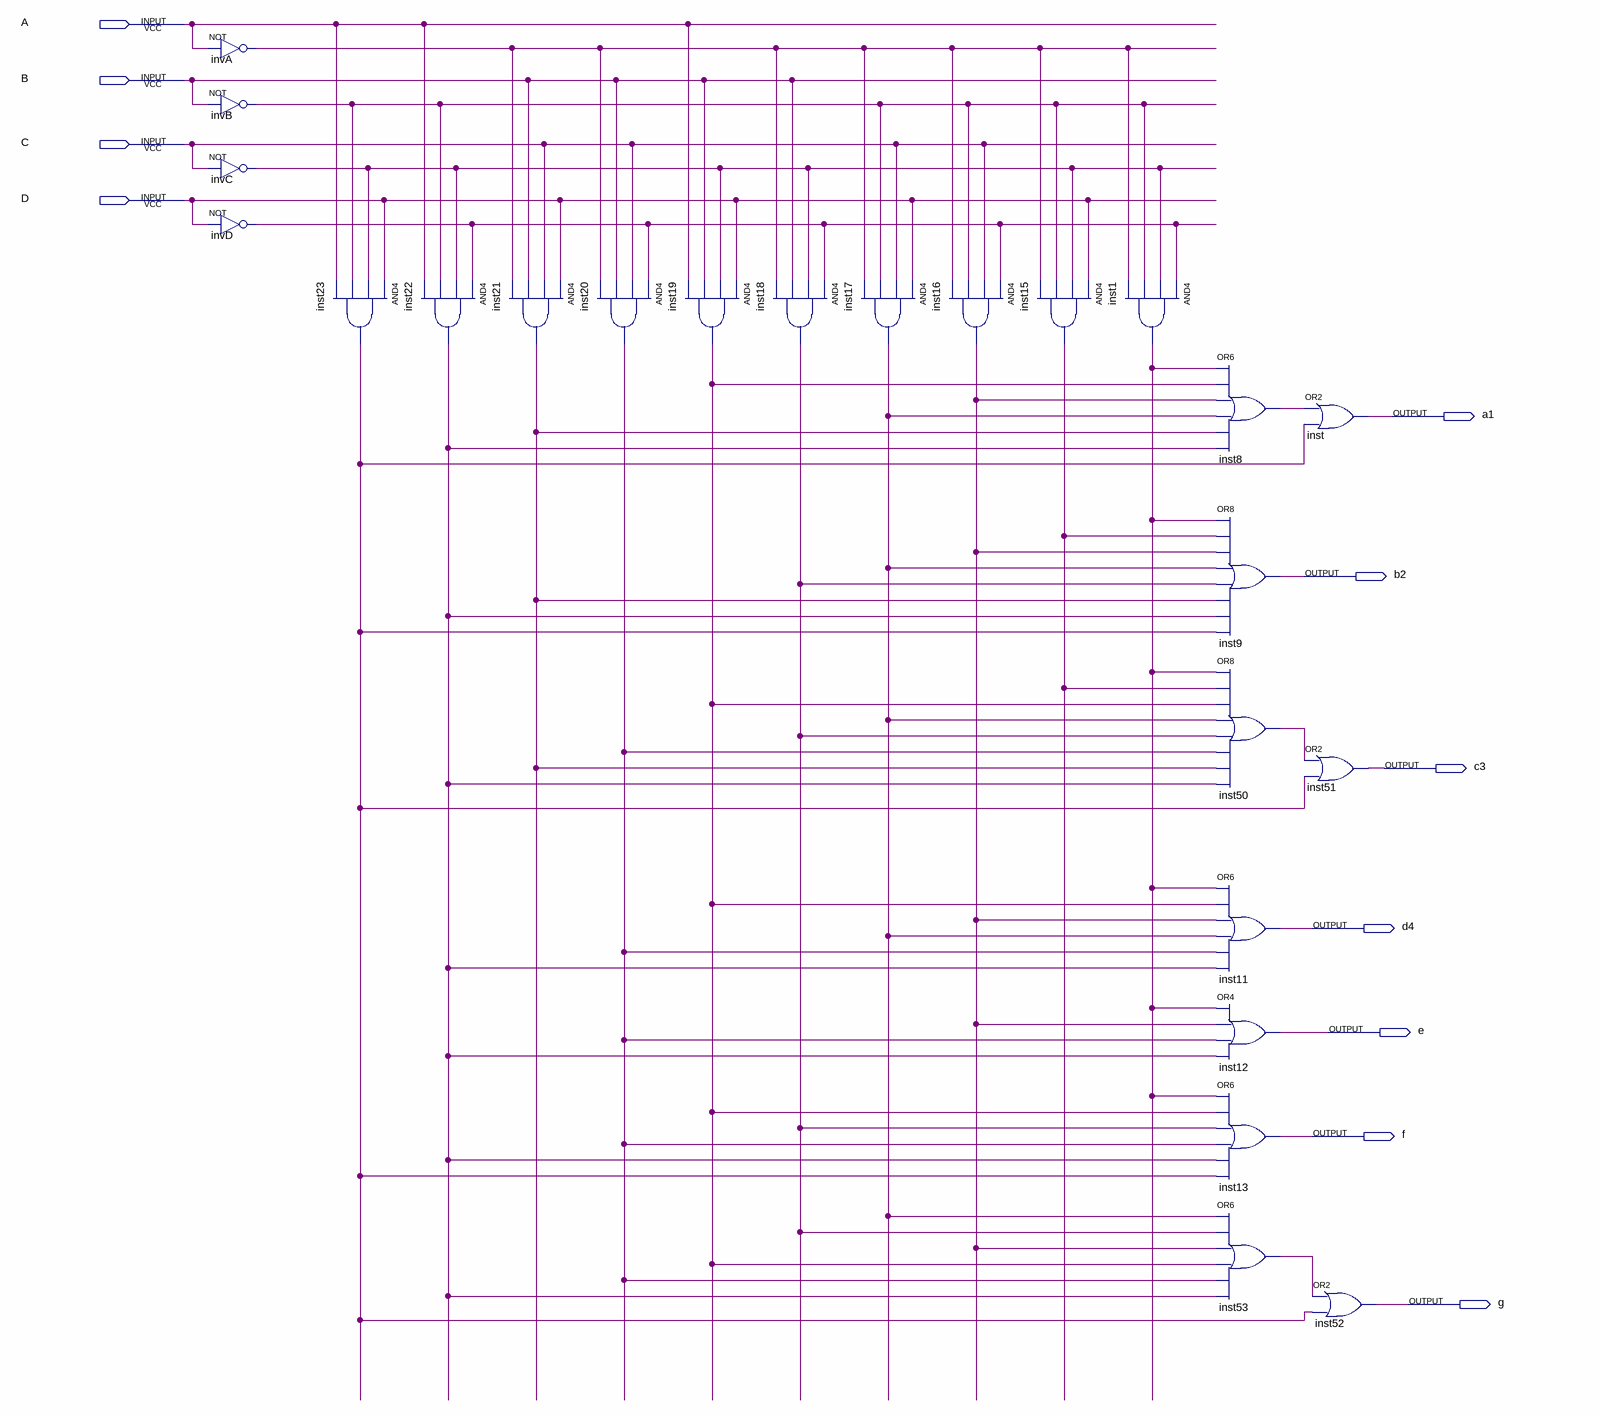
[diagram p0: schematic sheet]
// Quartus schematic DisplayOK.bdf as structural Verilog: 24 symbols, 11 pins
module DisplayOK (
  input  A,
  input  B,
  input  C,
  input  D,
  output a1,
  output b2,
  output c3,
  output d4,
  output e,
  output f,
  output g
);

  wire inst1_out, inst8_out, inst15_out, inst16_out, inst17_out, inst18_out, inst19_out, inst20_out,
       inst21_out, inst22_out, inst23_out, inst50_out, inst53_out, invA_out, invB_out, invC_out, invD_out;

  not invA (invA_out, A);
  not invB (invB_out, B);
  not invC (invC_out, C);
  not invD (invD_out, D);
  and inst23 (inst23_out, D, invC_out, invB_out, A);
  and inst22 (inst22_out, invD_out, invC_out, invB_out, A);
  and inst21 (inst21_out, D, C, B, invA_out);
  and inst20 (inst20_out, invD_out, C, B, invA_out);
  and inst19 (inst19_out, D, invC_out, B, A);
  and inst18 (inst18_out, invD_out, invC_out, B, invA_out);
  and inst17 (inst17_out, D, C, invB_out, invA_out);
  and inst16 (inst16_out, invD_out, C, invB_out, invA_out);
  and inst15 (inst15_out, D, invC_out, invB_out, invA_out);
  and inst1 (inst1_out, invD_out, invC_out, invB_out, invA_out);
  or inst8 (inst8_out, inst1_out, inst19_out, inst16_out, inst17_out, inst21_out, inst22_out);
  or inst9 (b2, inst1_out, inst15_out, inst16_out, inst17_out, inst18_out, inst21_out, inst22_out, inst23_out);
  or inst50 (inst50_out, inst1_out, inst15_out, inst19_out, inst17_out, inst18_out, inst20_out, inst21_out, inst22_out);
  or inst11 (d4, inst1_out, inst19_out, inst16_out, inst17_out, inst20_out, inst22_out);
  or inst12 (e, inst1_out, inst16_out, inst20_out, inst22_out);
  or inst13 (f, inst1_out, inst19_out, inst18_out, inst20_out, inst22_out, inst23_out);
  or inst53 (inst53_out, inst17_out, inst18_out, inst16_out, inst19_out, inst20_out, inst22_out);
  or inst (a1, inst8_out, inst23_out);
  or inst51 (c3, inst50_out, inst23_out);
  or inst52 (g, inst53_out, inst23_out);
endmodule
